# Altium schematic sheet Ethernet3.SchDoc: ETHERNET 3
size A3; Date: Not used; ApprovedBy: Not used; CheckedBy: Not used; Author: Not used; CompanyName: STMicroelectronics; DrawnBy: Not used; Engineer: Not used; Organization: Not used; Address1: Not used; Address2: Not used; Address3: Not used; Address4: Not used; DocumentNumber: Not used; Revision: Not used; SheetNumber: 9; SheetTotal: 18; CurrentTime: Not used; CurrentDate: Not used; Time: Not used; DocumentFullPathAndName: Not used; DocumentName: Not used; ModifiedDate: Not used; ImagePath: Not used; ProjectName: Not used; Application_BuildNumber: Not used
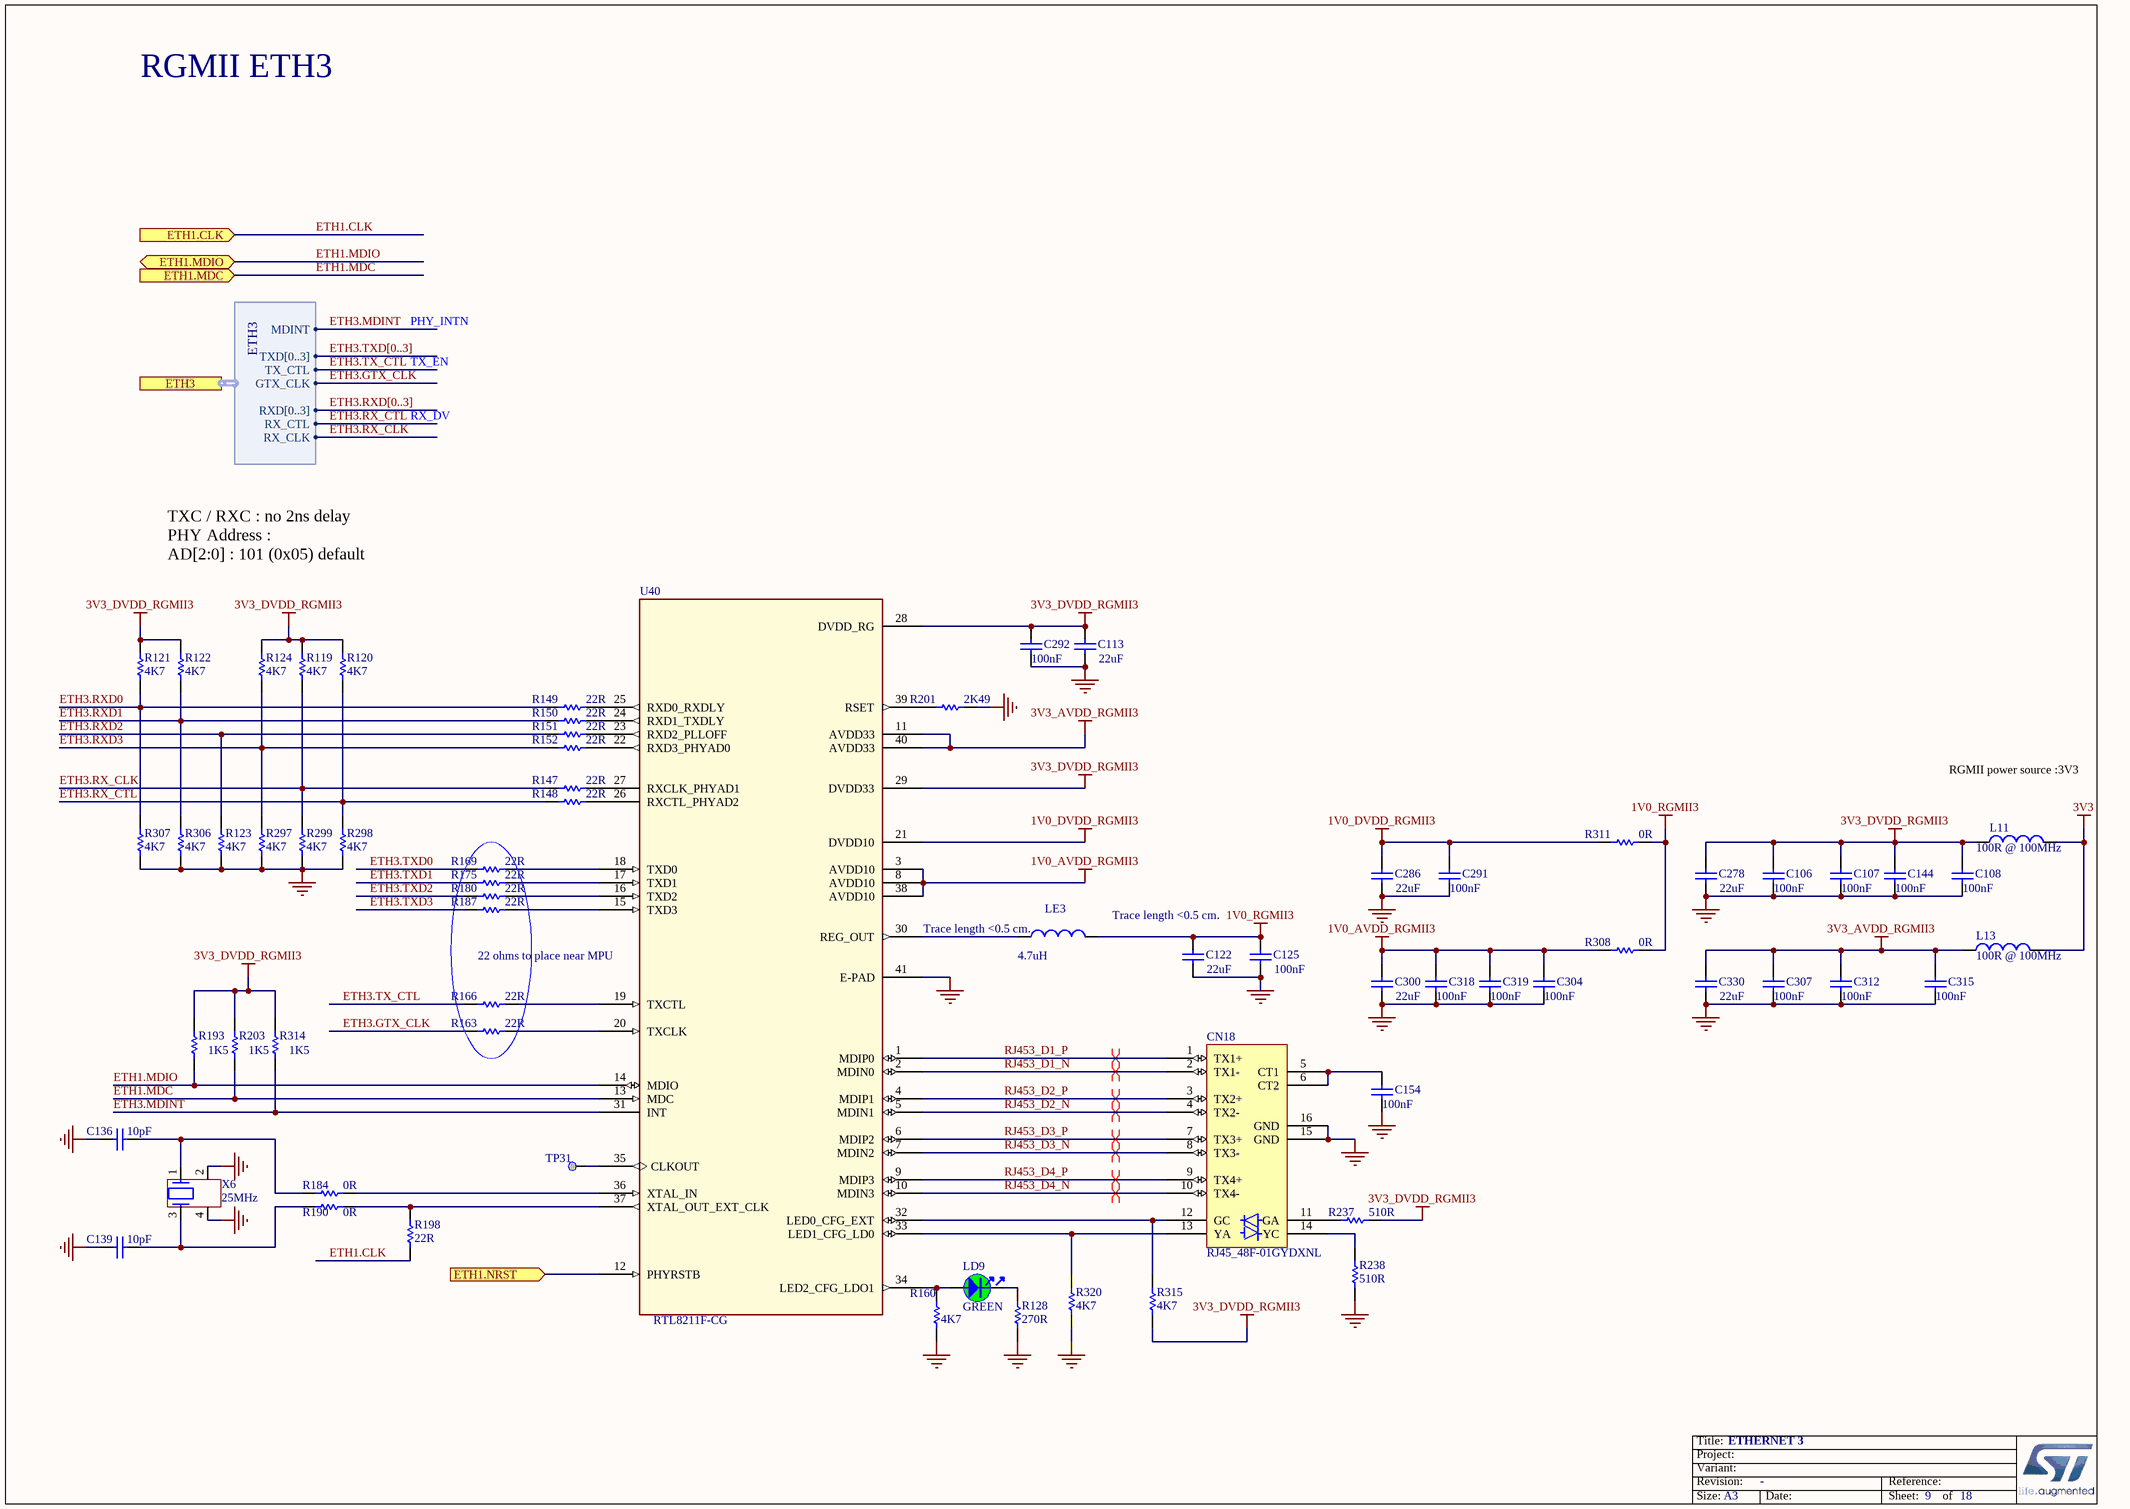
[diagram p0: Ethernet3.SchDoc]

## Parts
C106  value 100nF  [C0402]
C107  value 100nF  [C0402]
C108  value 100nF  [C0402]
C113  value 22uF  [C0603]
C122  value 22uF  [C0603]
C125  value 100nF  [C0402]
C136  value 10pF  [C0402]
C139  value 10pF  [C0402]
C144  value 100nF  [C0402]
C154  value 100nF  [C0402]
C278  value 22uF  [C0603]
C286  value 22uF  [C0603]
C291  value 100nF  [C0402]
C292  value 100nF  [C0402]
C300  value 22uF  [C0603]
C304  value 100nF  [C0402]
C307  value 100nF  [C0402]
C312  value 100nF  [C0402]
C315  value 100nF  [C0402]
C318  value 100nF  [C0402]
C319  value 100nF  [C0402]
C330  value 22uF  [C0603]
CN18  value RJ45_48F-01GYDXNL  [CON_RJ45_YD_48F-01GYDXNL_LED-P]  (hidden comment: ​New part for use of led pulled down on pin 13/14 , schematic more lisible.)
L11  value 100R @ 100MHz  [FIL_0603_H0P65]
L13  value 100R @ 100MHz  [FIL_0603_H0P65]
LD9  value GREEN  [LED_0603_OSRAM_LG-Q396-PS-35_GREEN_1A2K_H0P4]  (hidden comment: LED_green)
LE3  value 4.7uH  [L1210_LQH]
R119  value 4K7  [R0402]
R120  value 4K7  [R0402]
R121  value 4K7  [R0402]
R122  value 4K7  [R0402]
R123  value 4K7  [R0402]
R124  value 4K7  [R0402]
R128  value 270R  [R0402]  (hidden comment: Resistor)
R147  value 22R  [R0201_H0P23]  (hidden comment: Resistor)
R148  value 22R  [R0201_H0P23]  (hidden comment: Resistor)
R149  value 22R  [R0201_H0P23]  (hidden comment: Resistor)
R150  value 22R  [R0201_H0P23]  (hidden comment: Resistor)
R151  value 22R  [R0201_H0P23]  (hidden comment: Resistor)
R152  value 22R  [R0201_H0P23]  (hidden comment: Resistor)
R160  value 4K7  [R0402]
R163  value 22R  [R0201_H0P23]  (hidden comment: Resistor)
R166  value 22R  [R0201_H0P23]  (hidden comment: Resistor)
R169  value 22R  [R0201_H0P23]  (hidden comment: Resistor)
R175  value 22R  [R0201_H0P23]  (hidden comment: Resistor)
R180  value 22R  [R0201_H0P23]  (hidden comment: Resistor)
R184  value 0R  [R0402]
R187  value 22R  [R0201_H0P23]  (hidden comment: Resistor)
R190  value 0R  [R0402]
R193  value 1K5  [R0402]
R198  value 22R  [R0201_H0P23]  (hidden comment: Resistor)
R201  value 2K49  [R0402]
R203  value 1K5  [R0402]
R237  value 510R  [R0402]
R238  value 510R  [R0402]
R297  value 4K7  [R0402]
R298  value 4K7  [R0402]
R299  value 4K7  [R0402]
R306  value 4K7  [R0402]
R307  value 4K7  [R0402]
R308  value 0R  [R0603]
R311  value 0R  [R0603]
R314  value 1K5  [R0402]
R315  value 4K7  [R0402]
R320  value 4K7  [R0402]
TP31  Test Point  [TP_SMD_1MM]  (value not drawn)  (no BOM)
U40  RTL8211F-CG  [ICC_QFN40-EPAD_5X5_P040]
X6  value 25MHz  [CRY_NX3225HA_4P]  (hidden comment: XTAL_4_PINS)

## Ports
ETH1.CLK (in), ETH1.MDC (in), ETH1.MDIO (bidir), ETH1.NRST (in), ETH3 (harness ETH3)

## Harnesses
ETH3: MDINT, TXD[0..3], RX_CLK, GTX_CLK, TX_CTL, RXD[0..3], RX_CTL

## Nets
1V0_AVDD_RGMII3: C300.2 C304.2 C318.2 C319.2 R308.1 U40.3(AVDD10) U40.8(AVDD10) U40.38(AVDD10)
1V0_DVDD_RGMII3: C286.2 C291.2 R311.1 U40.21(DVDD10)
1V0_RGMII3: C122.2 C125.2 LE3.2 R308.2 R311.2
3V3: L11.2 L13.2
3V3_AVDD_RGMII3: C307.2 C312.2 C315.2 C330.2 L13.1 U40.11(AVDD33) U40.40(AVDD33)
3V3_DVDD_RGMII3: C106.2 C107.2 C108.2 C113.1 C144.2 C278.2 C292.2 L11.1 R119.2 R120.2 R121.2 R122.2 R124.2 R193.2 R203.2 R237.2 R314.2 R315.1 U40.28(DVDD_RG) U40.29(DVDD33)
GND: C106.1 C107.1 C108.1 C113.2 C122.1 C125.1 C136.1 C139.1 C144.1 C154.1 C278.1 C286.1 C291.1 C292.1 C300.1 C304.1 C307.1 C312.1 C315.1 C318.1 C319.1 C330.1 CN18.15(GND) CN18.16(GND) R123.1 R128.2 R160.1 R201.2 R238.1 R297.1 R298.1 R299.1 R306.1 R307.1 R320.1 U40.41(E-PAD) X6.2 X6.4
ETH1.CLK: R198.1 ; port ETH1.CLK
ETH1.MDC: R203.1 U40.13(MDC) ; port ETH1.MDC
ETH1.MDIO: R193.1 U40.14(MDIO) ; port ETH1.MDIO
ETH1.NRST: U40.12(PHYRSTB) ; port ETH1.NRST
ETH3.GTX_CLK: R163.1 ; port ETH3.GTX_CLK
ETH3.MDINT: R314.1 U40.31(INT) ; port ETH3.MDINT
ETH3.RX_CLK: R119.1 R147.1 R299.2 ; port ETH3.RX_CLK
ETH3.RX_CTL: R120.1 R148.1 R298.2 ; port ETH3.RX_CTL
ETH3.RXD0: R121.1 R149.1 R307.2
ETH3.RXD1: R122.1 R150.1 R306.2
ETH3.RXD2: R123.2 R151.1
ETH3.RXD3: R124.1 R152.1 R297.2
ETH3.TX_CTL: R166.1 ; port ETH3.TX_CTL
ETH3.TXD0: R169.1
ETH3.TXD1: R175.1
ETH3.TXD2: R180.1
ETH3.TXD3: R187.1
RJ453_D1_N: CN18.2(TX1-) U40.2(MDIN0)
RJ453_D1_P: CN18.1(TX1+) U40.1(MDIP0)
RJ453_D2_N: CN18.4(TX2-) U40.5(MDIN1)
RJ453_D2_P: CN18.3(TX2+) U40.4(MDIP1)
RJ453_D3_N: CN18.8(TX3-) U40.7(MDIN2)
RJ453_D3_P: CN18.7(TX3+) U40.6(MDIP2)
RJ453_D4_N: CN18.10(TX4-) U40.10(MDIN3)
RJ453_D4_P: CN18.9(TX4+) U40.9(MDIP3)
NetC136_2: C136.2 R184.1 X6.1
NetC139_2: C139.2 R190.1 X6.3
NetC154_2: C154.2 CN18.5(CT1) CN18.6(CT2)
NetCN18_11: CN18.11(GA) R237.1
NetCN18_12: CN18.12(GC) R315.2 U40.32(LED0_CFG_EXT)
NetCN18_13: CN18.13(YA) R320.2 U40.33(LED1_CFG_LD0)
NetCN18_14: CN18.14(YC) R238.2
NetLD9_1: LD9.1 R160.2 U40.34(LED2_CFG_LDO1)
NetLD9_2: LD9.2 R128.1
NetLE3_1: LE3.1 U40.30(REG_OUT)
NetR147_2: R147.2 U40.27(RXCLK_PHYAD1)
NetR148_2: R148.2 U40.26(RXCTL_PHYAD2)
NetR149_2: R149.2 U40.25(RXD0_RXDLY)
NetR150_2: R150.2 U40.24(RXD1_TXDLY)
NetR151_2: R151.2 U40.23(RXD2_PLLOFF)
NetR152_2: R152.2 U40.22(RXD3_PHYAD0)
NetR163_2: R163.2 U40.20(TXCLK)
NetR166_2: R166.2 U40.19(TXCTL)
NetR169_2: R169.2 U40.18(TXD0)
NetR175_2: R175.2 U40.17(TXD1)
NetR180_2: R180.2 U40.16(TXD2)
NetR184_2: R184.2 U40.36(XTAL_IN)
NetR187_2: R187.2 U40.15(TXD3)
NetR190_2: R190.2 R198.2 U40.37(XTAL_OUT_EXT_CLK)
NetR201_1: R201.1 U40.39(RSET)
NetTP31_1: TP31.1 U40.35(CLKOUT)

## Buses and harness runs
bus ETH3.RXD[0..3]
bus ETH3.TXD[0..3]

## Layout directives
differential pair: RJ453_D1_N, RJ453_D1_P, RJ453_D2_N, RJ453_D2_P, RJ453_D3_N, RJ453_D3_P, RJ453_D4_N, RJ453_D4_P

## Notes on the sheet
- RGMII ETH3
- PHY_INTN
- TX_EN
- RX_DV
- TXC / RXC : no 2ns delay
  PHY Address :
  AD[2:0] : 101 (0x05) default
- RGMII power source :3V3
- Trace length <0.5 cm.
- (near U40) 22 ohms to place near MPU
- (near LE3) Trace length <0.5 cm.
- Title:
- Project:
- Size:
- Revision:
- Variant:
- A3
- -
- Date:
- Reference:
- Sheet:
- of

## Library data of the parts
C106-C108 C125 C144 C154 C291 C292 C304 C307 C312 C315 C318 C319 = MCD-00006: Capacitor,100nF,16V,X7R,10%,0402; Manufacturer_Part_Number: CC0402KRX7R7BB104; Manufacturer: YAGEO; Alternate_Manufacturer: MURATA; Alternate_Manufacturer_Part_Number: GCM155R71C104KA55D; Part_Preference: Recommended; Provided_By: SUBCO; Initial_Board_Reference: mb1274; Order_Code_RS: 616-9701; Component_Country_Of_Origin: China; ID: 2474; ShowFields: YES; Internal_Part_Number: MCD-00006; ComponentLink1Description: Datasheet; ECCN_US: n/a; ECCN_EU: n/a; Status: Released; Part_Type: Capacitor; Package: 0402; ComponentLink1URL: http://tunmcdsvn.tun.st.com/Component_Documentation_Library/Trunk/Capacitor/YAGEO_X7R_Series; Order_Code_Digikey: 311-1338-1-ND; Order_Code_Farnell: 9402047
C113 C122 C278 C286 C300 C330 = MCD-00100: Capacitor,22uF,6V3,X5R,20%,0603; Manufacturer_Part_Number: GRM188R60J226MEA0J; Manufacturer: MURATA; Part_Preference: Recommended; ECCN_US: EAR99; ECCN_EU: NEC; Provided_By: SUBCO; Initial_Board_Reference: mb1262; Component_Country_Of_Origin: Japan; ID: 2766; ShowFields: YES; Internal_Part_Number: MCD-00100; ComponentLink1Description: Datasheet; Status: Released; Part_Type: Capacitor; Package: 0603; ComponentLink1URL: http://tunmcdsvn.tun.st.com/Component_Documentation_Library/Trunk/Capacitor/MURATA_GRM_Series; Order_Code_Digikey: 490-7612-2-ND; Order_Code_Farnell: N/A; Order_Code_RS: N/A
C136 C139 = MCD-00015: Capacitor,10pF,50V,NPO,5%,0402; Manufacturer_Part_Number: CC0402JRNPO9BN100; Manufacturer: YAGEO; Part_Preference: Recommended; Provided_By: SUBCO; Initial_Board_Reference: mb1274; Order_Code_RS: 616-9256; Component_Country_Of_Origin: China; ID: 2465; ShowFields: YES; Internal_Part_Number: MCD-00015; ComponentLink1Description: Datasheet; ECCN_US: n/a; ECCN_EU: n/a; Status: Released; Part_Type: Capacitor; Package: 0402; ComponentLink1URL: http://tunmcdsvn.tun.st.com/Component_Documentation_Library/Trunk/Capacitor/YAGEO_NP0_Series; Order_Code_Digikey: 311-1014-1-ND; Order_Code_Farnell: 3019160RL
CN18 = MCD-01129: Connector_RJ45, led pull down, T= 13.84mm; Manufacturer_Part_Number: 48F-01GYDXNL; Manufacturer: YUAN DEAN SCIENTIFIC; Part_Preference: Recommended; Component_Country_Of_Origin: Unknown; ID: 3367; ShowFields: YES; Internal_Part_Number: MCD-01129; Status: New; Part_Type: Connector; ComponentLink1URL: http://tunmcdsvn.tun.st.com/Component_Documentation_Library/Trunk/Connector/YUAN_DEAN_SCIENTIFIC_48F_Series/; Order_Code_Digikey: N/A; Order_Code_Farnell: N/A; Order_Code_RS: N/A
L11 L13 = MCD-00094: Ferrite bead 100R 2A 0603; Manufacturer_Part_Number: BLM18EG101TN1; Manufacturer: MURATA; Part_Type: Inductor; Part_Preference: Recommended; ECCN_US: EAR99; ECCN_EU: NEC; Provided_By: SUBCO; Initial_Board_Reference: mb1262; Order_Code_RS: 792-6246; Component_Country_Of_Origin: Japan; ID: 2774; ShowFields: YES; Internal_Part_Number: MCD-00094; ComponentLink1Description: Datasheet; Status: Released; ComponentLink1URL: http://tunmcdsvn.tun.st.com/Component_Documentation_Library/Trunk/Inductor/MURATA_BLM_Series; Order_Code_Digikey: 490-5978-2-ND; Order_Code_Farnell: 1515714; Package: 0603
LD9 = MCD-00588: LED Green, 0603 SMD, Forward Voltage Typ=2V, Max=2.5V; Part_Type: Display; Manufacturer_Part_Number: LG Q396-PS-35; Manufacturer: OSRAM OPTO SEMICONDUCTORS; Alternate_Manufacturer_Part_Number: VLMTG1300-GS08; Alternate_Manufacturer: VISHAY SEMICONDUCTOR OPTO DIVISION; Alternate_Internal_Part_Number: MCD-02400; Part_Preference: Recommended; Provided_By: SUBCO; Component_Country_Of_Origin: Unknown; ID: 3155; ShowFields: YES; Internal_Part_Number: MCD-00588; Status: Released; Package: LED 0603; ComponentLink1Description: Datasheet; ComponentLink1URL: http://tunmcdsvn.tun.st.com/Component_Datasheet_Library/Trunk/Display/OSRAM_LED_GREEN_LG Q396-PS-35; Order_Code_Digikey: LG Q396-PS-35-ND; ECCN_US: n/a; ECCN_EU: n/a
LE3 = MCD-00048: FIXED IND 4.7UH 1A 180 MOHM 30% SMD; Manufacturer_Part_Number: LQH32PN4R7NN0L; Manufacturer: MURATA; Part_Preference: Recommended; Provided_By: SUBCO; Initial_Board_Reference: mb1274; Order_Code_RS: 167-4086; Component_Country_Of_Origin: Japan; ID: 2544; ShowFields: YES; Internal_Part_Number: MCD-00048; ComponentLink1Description: Datasheet; ECCN_US: n/a; ECCN_EU: n/a; Status: Released; Part_Type: Inductor; ComponentLink1URL: http://tunmcdsvn.tun.st.com/Component_Documentation_Library/Trunk/Inductor/MURATA_LQH32PN4R7NN0; Order_Code_Digikey: 490-5338-2-ND; Order_Code_Farnell: 2470296; Package: 1210
R119-R124 R297-R299 R306 R307 = MCD-00065: Resistor,4K7,0402,1%,1/16W; Manufacturer_Part_Number: RC0402FR-074K7L; Manufacturer: YAGEO; Alternate_Manufacturer_Part_Number: RT0402FRE074K7L; Provided_By: SUBCO; Initial_Board_Reference: mb1274; Internal_Part_Number: MCD-00065; Alternate_Manufacturer: YAGEO; ComponentLink1Description: Datasheet; ECCN_US: n/a; ECCN_EU: n/a; Status: Released; Part_Type: Resistor; ComponentLink1URL: http://tunmcdsvn.tun.st.com/Component_Datasheet_Library/Trunk/Resistors/Yageo_Resistor_RC0402-series; Package: R0402
R128 = MCD-00441: Resistor,270R,0402,1%,1/16W; Manufacturer_Part_Number: RC0402FR-07270RL; Manufacturer: YAGEO; Part_Preference: Recommended; Provided_By: SUBCO; ECCN_US: EAR99; ECCN_EU: NEC; Component_Country_Of_Origin: China; ID: 2838; ShowFields: YES; Internal_Part_Number: MCD-00441; Status: Released; Part_Type: Resistor; Package: 0402; ComponentLink1Description: Datasheet; ComponentLink1URL: http://tunmcdsvn.tun.st.com/Component_Documentation_Library/Trunk/Resistor/YAGEO_RC_L_Series; Order_Code_Digikey: 311-270LRCT-ND; Order_Code_Farnell: 9239162; Order_Code_RS: N/A
R147-R152 R163 R166 R169 R175 R180 R187 R198 = MCD-02978: Resistor, 22R, 0201, +/-1%, 1/20W; Manufacturer_Part_Number: RC0201FR-0722RL; Manufacturer: YAGEO; Part_Preference: Recommended; Order_Code_RS: 198-7593; ID: 5094; ShowFields: YES; Internal_Part_Number: MCD-02978; Status: New; Part_Type: Resistor; ComponentLink1URL: http://tunmcdsvn.tun.st.com/Component_Documentation_Library/Trunk/Resistor/YAGEO_RC_L_Series; Package: 0201; Order_Code_Digikey: YAG2518TR-ND; Order_Code_Farnell: 2693564
R160 R315 R320 = MCD-00065: Resistor,4K7,0402,1%,1/16W; Manufacturer_Part_Number: RC0402FR-074K7L; Manufacturer: YAGEO; Alternate_Manufacturer_Part_Number: RT0402FRE074K7L; Part_Preference: Recommended; Provided_By: SUBCO; Initial_Board_Reference: mb1274; Component_Country_Of_Origin: China; ID: 2526; ShowFields: YES; Internal_Part_Number: MCD-00065; Alternate_Manufacturer: YAGEO; ComponentLink1Description: Datasheet; ECCN_US: n/a; ECCN_EU: n/a; Status: Released; Part_Type: Resistor; ComponentLink1URL: http://tunmcdsvn.tun.st.com/Component_Documentation_Library/Trunk/Resistor/YAGEO_RC_L_Series; Package: 0402; Order_Code_Digikey: 311-4.7KLRCT-ND; Order_Code_Farnell: 9239316; Order_Code_RS: N/A
R184 R190 = MCD-00052: Resistor,0R,0402,5%,1/16W; Manufacturer_Part_Number: RC0402JR-070RL; Manufacturer: YAGEO; Part_Preference: Recommended; Provided_By: SUBCO; Initial_Board_Reference: mb1274; Order_Code_RS: 618-5804; Component_Country_Of_Origin: China; ID: 2540; ShowFields: YES; Internal_Part_Number: MCD-00052; ComponentLink1Description: Datasheet; ECCN_US: n/a; ECCN_EU: n/a; Status: Released; Part_Type: Resistor; ComponentLink1URL: http://tunmcdsvn.tun.st.com/Component_Documentation_Library/Trunk/Resistor/YAGEO_RC_L_Series; Package: 0402; Order_Code_Digikey: 311-0.0JRCT-ND; Order_Code_Farnell: 9232516RL
R193 R203 R314 = MCD-00068: Resistor,1K5,0402,1%,1/16W; Manufacturer_Part_Number: RC0402FR-071K5L; Manufacturer: YAGEO; Part_Preference: Recommended; Provided_By: SUBCO; Initial_Board_Reference: mb1274; Component_Country_Of_Origin: China; ID: 2524; ShowFields: YES; Internal_Part_Number: MCD-00068; ComponentLink1Description: Datasheet; ECCN_US: n/a; ECCN_EU: n/a; Status: Released; Part_Type: Resistor; ComponentLink1URL: http://tunmcdsvn.tun.st.com/Component_Documentation_Library/Trunk/Resistor/YAGEO_RC_L_Series; Package: 0402; Order_Code_Digikey: 311-1.50KLRCT-ND; Order_Code_Farnell: 9239251; Order_Code_RS: N/A
R201 = MCD-00183: Resistor,2K49,0402,1%,1/16W; Manufacturer_Part_Number: RC0402FR-072K49L; Manufacturer: YAGEO; Part_Preference: Recommended; Provided_By: SUBCO; Component_Country_Of_Origin: China; ID: 2687; ShowFields: YES; Internal_Part_Number: MCD-00183; ComponentLink1Description: Datasheet; ECCN_US: n/a; ECCN_EU: n/a; Status: Released; Part_Type: Resistor; ComponentLink1URL: http://tunmcdsvn.tun.st.com/Component_Documentation_Library/Trunk/Resistor/YAGEO_RC_L_Series; Package: 0402; Order_Code_Digikey: 311-2.49KLRCT-ND; Order_Code_Farnell: 1799190; Order_Code_RS: N/A
R237 R238 = MCD-00064: Resistor,510R,0402,1%,1/16W; Manufacturer_Part_Number: RC0402FR-07510RL; Manufacturer: YAGEO; Part_Preference: Recommended; Provided_By: SUBCO; Initial_Board_Reference: mb1274; Component_Country_Of_Origin: China; ID: 2525; ShowFields: YES; Internal_Part_Number: MCD-00064; ComponentLink1Description: Datasheet; ECCN_US: n/a; ECCN_EU: n/a; Status: Released; Part_Type: Resistor; ComponentLink1URL: http://tunmcdsvn.tun.st.com/Component_Documentation_Library/Trunk/Resistor/YAGEO_RC_L_Series; Package: 0402; Order_Code_Digikey: 311-510LRCT-ND; Order_Code_Farnell: 1458804; Order_Code_RS: N/A
R308 R311 = MCD-00056: Resistor,0R,0603,5%,1/10W; Manufacturer_Part_Number: RC0603JR-070RL; Manufacturer: YAGEO; Part_Preference: Recommended; Provided_By: SUBCO; Initial_Board_Reference: mb1274; Component_Country_Of_Origin: China; ID: 2536; ShowFields: YES; Internal_Part_Number: MCD-00056; ComponentLink1Description: Datasheet; ECCN_US: n/a; ECCN_EU: n/a; Status: Released; Part_Type: Resistor; ComponentLink1URL: http://tunmcdsvn.tun.st.com/Component_Documentation_Library/Trunk/Resistor/YAGEO_RC_L_Series; Package: 0603; Order_Code_Digikey: 311-0.0GRCT-ND; Order_Code_Farnell: 9233130RL; Order_Code_RS: N/A
TP31 = MCD-00074: Test Point 1mm; Part_Type: Misc; Part_Preference: Recommended; Initial_Board_Reference: MB1274; ID: 2518; ShowFields: YES; Internal_Part_Number: MCD-00074; Status: Released; Manufacturer_Part_Number: n/a; Manufacturer: n/a; ComponentLink1Description: Datasheet; ComponentLink1URL: http://na; ECCN_US: n/a; ECCN_EU: n/a; Provided_By: n/a; Order_Code_Digikey: N/A; Order_Code_Farnell: N/A; Order_Code_RS: N/A
U40 = MCD-01130: 10/100/1000M GIGABIT Ethernet Transceiver, QFN40 , SMPS version; Manufacturer: REALTEK; Part_Type: IC; Part_Preference: Recommended; Provided_By: SUBCO; Initial_Board_Reference: MB1272; Component_Country_Of_Origin: Unknown; ID: 3370; ShowFields: YES; Value: RTL8211F-CG; Internal_Part_Number: MCD-01130; Manufacturer_Part_Number: RTL8211F-CG; ComponentLink1Description: Datasheet; ComponentLink1URL: http://tunmcdsvn.tun.st.com/Component_Datasheet_Library/Trunk/IC/REALTEK_RTL8211F_RGMII_phy; Status: Checked; ECCN_US: n/a; ECCN_EU: n/a
X6 = MCD-01463: Crystal 25Mhz, 10pF, -+50PPM, SMD; Part_Type: Crystal_Osc; Manufacturer_Part_Number: NX3225GA-25MHZ-EXS00A-CG06750; Manufacturer: NDK; BMS_Part_Number: 9157035; Part_Preference: Recommended; Provided_By: SUBCO; Initial_Board_Reference: MB1272B; Remark: footprint same as CRY_NX3225HA_4P; Component_Country_Of_Origin: Unknown; ID: 3563; ShowFields: YES; Internal_Part_Number: MCD-01463; Status: Checked; Package: 3.2x2.5mm; ComponentLink1Description: Datasheet; ComponentLink1URL: http://tunmcdsvn.tun.st.com/Component_Documentation_Library/Trunk/Crytal_Oscillator/NDK_NX3225GA_Series; Order_Code_Digikey: 644-1390; Order_Code_Farnell: N/A; Order_Code_RS: N/A